# Altium project harmonicAnalyzerProject_r002.PrjPCB
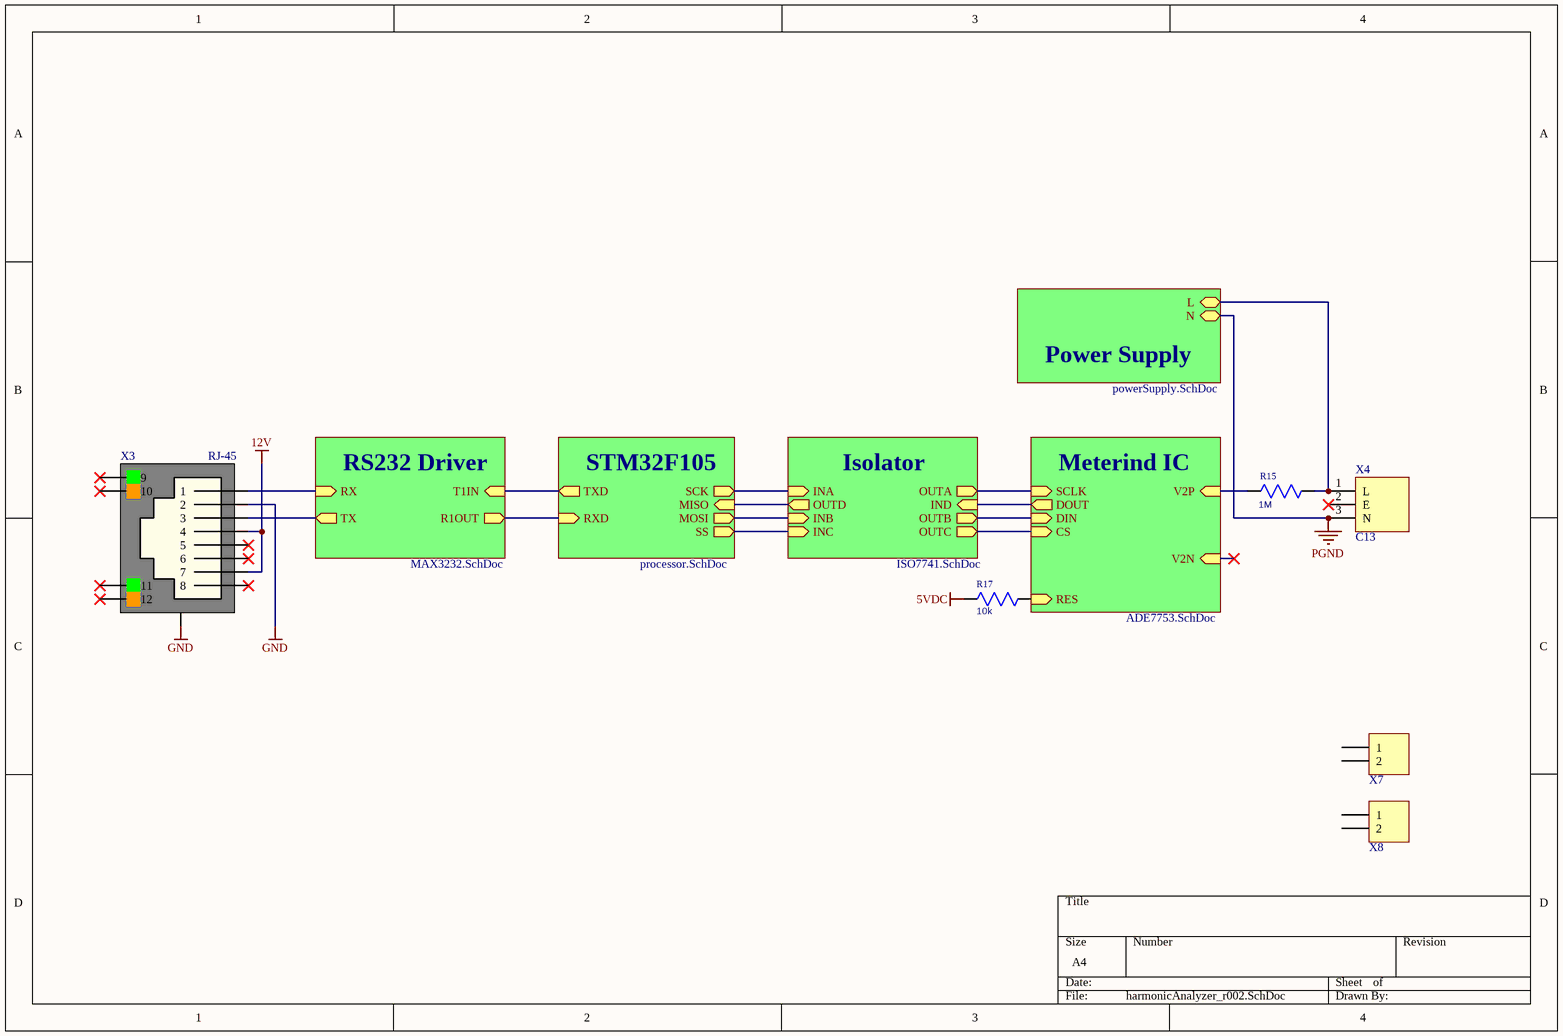
[diagram p0: harmonicAnalyzer_r002.SchDoc]
6 sheets, 90 parts. Net scope: hierarchical (ports join the sheet entries above them; power ports are global).
Board file: harmonicAnalyzerPcb_r002.PcbDoc
Sheets:
  harmonicAnalyzer_r002.SchDoc
    RS232 Driver = MAX3232.SchDoc
    STM32F105 = processor.SchDoc
    Power Supply = powerSupply.SchDoc
    Isolator = ISO7741.SchDoc
    Meterind IC = ADE7753.SchDoc

## Sheet harmonicAnalyzer_r002.SchDoc
size A4

### Parts
R15  1M  [R_0805]
R17  10k  [R_0603]
X3  RJ-45  [RJHSE-5E8X]
X4  C13  [C13_RA_TH]
X7  PBS-2  [PBS-2-3D]  (value not drawn)
X8  PBS-2  [PBS-2-3D]  (value not drawn)

### Sub-sheets
Isolator = ISO7741.SchDoc: OUTC (out), IND (in), INC (in), OUTD (out), INA (in), OUTB (out), OUTA (out), INB (in)
Meterind IC = ADE7753.SchDoc: DOUT (out), CS (in), V2N (in), V2P (in), DIN (in), RES (in), SCLK (in)
Power Supply = powerSupply.SchDoc: N (bidir), L (bidir)
RS232 Driver = MAX3232.SchDoc: T1IN (in), RX (in), TX (out), R1OUT (out)
STM32F105 = processor.SchDoc: MOSI (out), SS (out), MISO (in), RXD (in), SCK (out), TXD (out)

### Nets
5VDC: R17.1
12V: X3.4 X3.7
GND: X3.2 X3.13
PGND: X4.3(N) ; sheet Power Supply/N
CS: sheet Isolator/OUTC, sheet Meterind IC/CS
DIN: sheet Isolator/OUTB, sheet Meterind IC/DIN
DOUT: sheet Isolator/IND, sheet Meterind IC/DOUT
INA: sheet STM32F105/SCK, sheet Isolator/INA
INB: sheet STM32F105/MOSI, sheet Isolator/INB
INC: sheet STM32F105/SS, sheet Isolator/INC
OUTA: sheet Isolator/OUTA, sheet Meterind IC/SCLK
OUTD: sheet STM32F105/MISO, sheet Isolator/OUTD
R1OUT: sheet RS232 Driver/R1OUT, sheet STM32F105/RXD
RES: R17.2 ; sheet Meterind IC/RES
RX: X3.1 ; sheet RS232 Driver/RX
T1IN: sheet RS232 Driver/T1IN, sheet STM32F105/TXD
TX: X3.3 ; sheet RS232 Driver/TX
V2P: R15.1 ; sheet Meterind IC/V2P
NetFUSE1_1: R15.2 X4.1(L) ; sheet Power Supply/L

Not connected (* = marked no-connect by the designer): X3 5* 6* 8* 9* 10* 11* 12*; X4 2(E)*; X7 1 2; X8 1 2

### Library data of the parts
R15 = R0805: Resistor; Value: 1M
R17 = R0603: Resistor; Value: 10k
X3 = RJ-45: Jack Modular Connector
X7 X8 = PBS-2: Header, 2-Pin; LatestRevisionDate: 17-Jul-2002; LatestRevisionNote: Re-released for DXP Platform.; Publisher: Altium Limited

## Sheet MAX3232.SchDoc
size A4
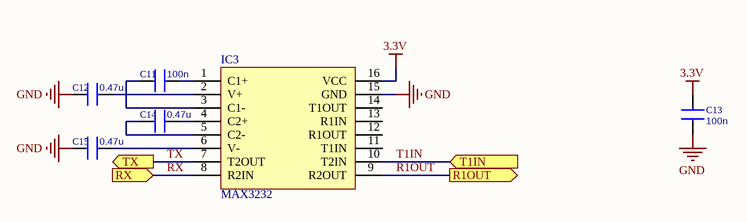
[diagram p1: MAX3232.SchDoc]

### Parts
C11  100n  [C_0805]
C12  0.47u  [C_0805]
C13  100n  [C_0805]
C14  0.47u  [C_0805]
C15  0.47u  [C_0805]
IC3  MAX3232  [SSOP-16]

### Ports
R1OUT (out), RX (in), T1IN (in), TX (out)

### Nets
3.3V: C13.2 IC3.16(VCC)
GND: C12.1 C13.1 C15.1 IC3.15(GND)
R1OUT: IC3.9(R2OUT) ; port R1OUT
RX: IC3.8(R2IN) ; port RX
T1IN: IC3.10(T2IN) ; port T1IN
TX: IC3.7(T2OUT) ; port TX
NetC11_1: C11.1 IC3.3(C1-)
NetC11_2: C11.2 IC3.1(C1+)
NetC12_2: C12.2 IC3.2(V+)
NetC14_1: C14.1 IC3.5(C2-)
NetC14_2: C14.2 IC3.4(C2+)
NetC15_2: C15.2 IC3.6(V-)

Not connected (* = marked no-connect by the designer): IC3 11(T1IN) 12(R1OUT) 13(R1IN) 14(T1OUT)

### Library data of the parts
C11-C15 = C0805: Capacitor
  C11 C13: Value: 100n
  C12 C14 C15: Value: 0.47u
IC3 = MAX3232: RS-232 Line Driver/Receiver With ±15-kV ESD Protection

## Sheet processor.SchDoc
size A4
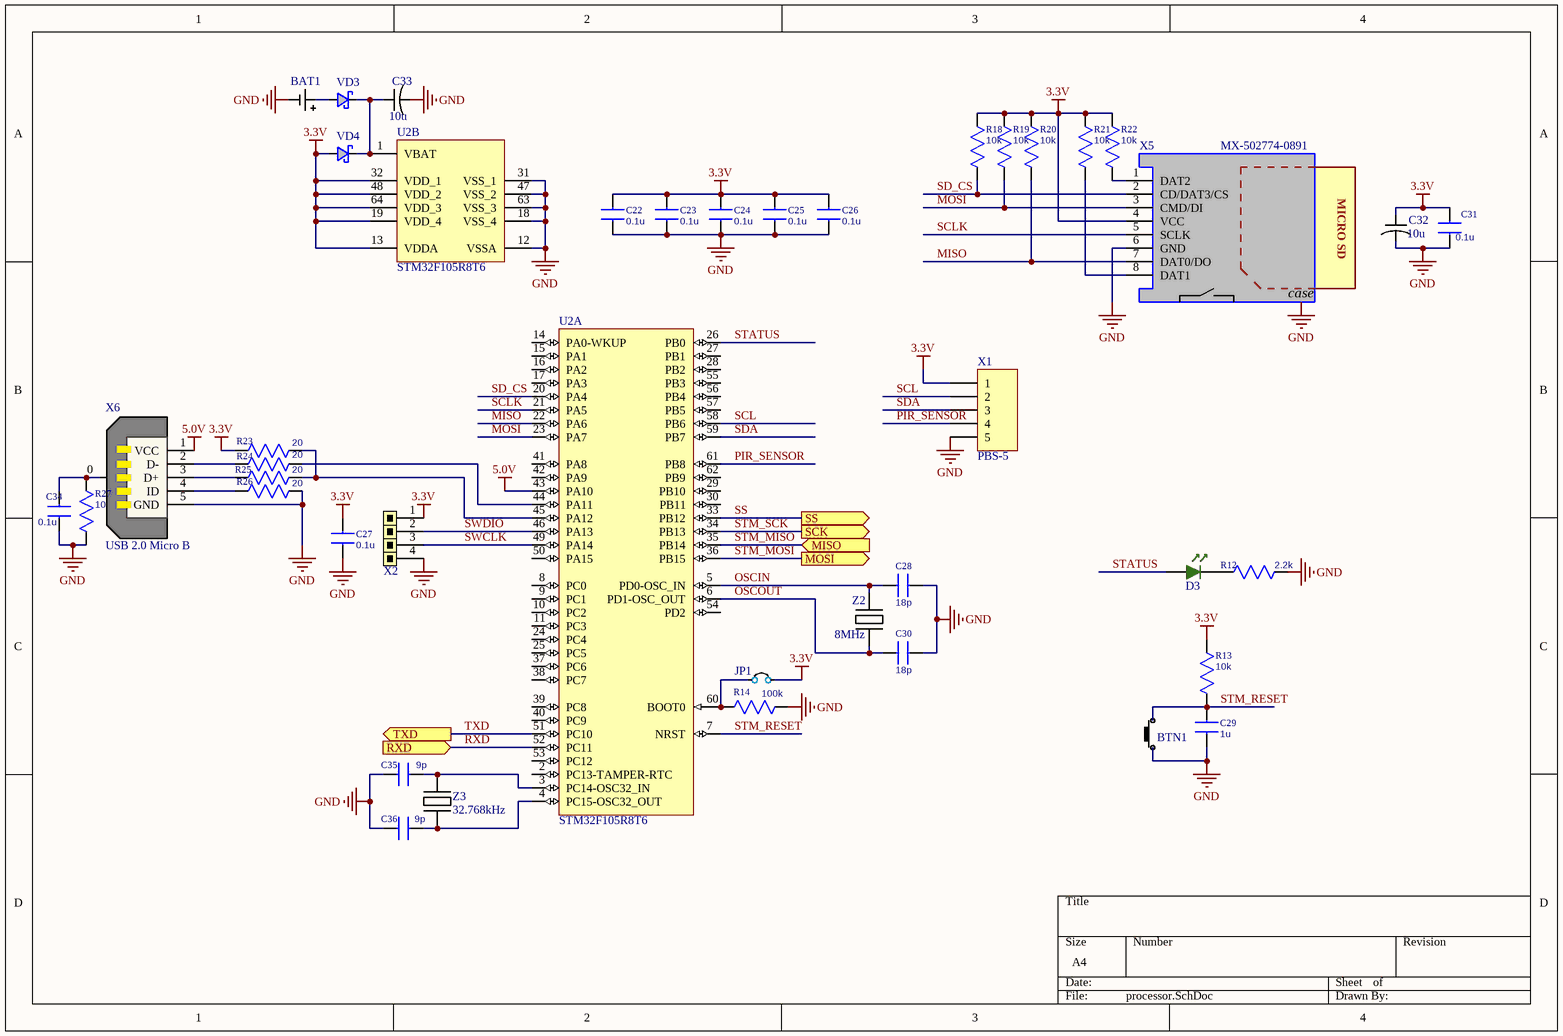
[diagram p2: processor.SchDoc]

### Parts
BAT1  Battery  [S8411-45R]  (value not drawn)
BTN1  Push Button  [PUSH BUTTON RIGHT ANGLE]  (value not drawn)
C22  0.1u  [C_0603]
C23  0.1u  [C_0603]
C24  0.1u  [C_0603]
C25  0.1u  [C_0603]
C26  0.1u  [C_0603]
C27  0.1u  [C_0603]
C28  18p  [C_0603]
C29  1u  [C_0603]
C30  18p  [C_0603]
C31  0.1u  [C_0603]
C32  10u  [TANTALUM_CAP_SIZE_A]
C33  10u  [TANTALUM_CAP_SIZE_A]
C34  0.1u  [C_0603]
C35  9p  [C_0603]
C36  9p  [C_0603]
D3  LED Green  [LED GREEN 3MM]  (value not drawn)
JP1  PLS-2  [PLS-2]  (value not drawn)
R12  2.2k  [R_0603]
R13  10k  [R_0603]
R14  100k  [R_0603]
R18  10k  [R_0603]
R19  10k  [R_0603]
R20  10k  [R_0603]
R21  10k  [R_0603]
R22  10k  [R_0603]
R23  20  [R_0603]
R24  20  [R_0603]
R25  20  [R_0603]
R26  20  [R_0603]
R27  10  [R_0603]
U2  STM32F105R8T6  [STM-LQFP64_N]  (parts A,B of 2)
VD3  Schottky Diode  [DO-214AA]  (value not drawn)
VD4  Schottky Diode  [DO-214AA]  (value not drawn)
X1  PBS-5  [PBS-5-3D]
X2  PLS-4  [PLS-4]  (value not drawn)
X5  MX-502774-0891  [MICRO SD SOCKET 2]
X6  USB 2.0 Micro B  [USB 2.0 MICRO B]
Z2  8MHz  [HC-49]
Z3  32.768kHz  [ST2012SB]

### Ports
MISO (in), MOSI (out), RXD (in), SCK (out), SS (out), TXD (out)

### Nets
3.3V: C22.1 C23.1 C24.1 C25.1 C26.1 C27.1 C31.1 C32.1 JP1.2 R13.1 R18.2 R19.2 R20.2 R21.2 R22.2 R23.1 U2.13(VDDA) U2.19(VDD_4) U2.32(VDD_1) U2.48(VDD_2) U2.64(VDD_3) VD4.A X1.1 X2.1 X5.4(VCC)
5.0V: U2.43(PA10) X6.1(VCC)
GND: BAT1.- BTN1.2 C22.2 C23.2 C24.2 C25.2 C26.2 C27.2 C28.1 C29.1 C30.1 C31.2 C32.2 C33.2 C34.2 C35.1 C36.1 R12.2 R14.1 R26.2 R27.2 U2.12(VSSA) U2.18(VSS_4) U2.31(VSS_1) U2.47(VSS_2) U2.63(VSS_3) X1.5 X2.4 X5.0(PCK) X5.6(GND) X6.5(GND)
MISO: R20.1 U2.22(PA6) X5.7(DAT0/DO)
MOSI: R19.1 U2.23(PA7) X5.3(CMD/DI)
OSCIN: C28.2 U2.5(PD0-OSC_IN) Z2.2
OSCOUT: C30.2 U2.6(PD1-OSC_OUT) Z2.1
PIR_SENSOR: U2.61(PB8) X1.4
RXD: U2.52(PC11) ; port RXD  [project net R1OUT]
SCL: U2.58(PB6) X1.2
SCLK: U2.21(PA5) X5.5(SCLK)
SD_CS: R18.1 U2.20(PA4) X5.2(CD/DAT3/CS)
SDA: U2.59(PB7) X1.3
SS: U2.33(PB12) ; port SS  [project net INC]
STATUS: D3.A U2.26(PB0)
STM_MISO: U2.35(PB14) ; port MISO  [project net OUTD]
STM_MOSI: U2.36(PB15) ; port MOSI  [project net INB]
STM_RESET: BTN1.1 C29.2 R13.2 U2.7(NRST)
STM_SCK: U2.34(PB13) ; port SCK  [project net INA]
SWCLK: U2.49(PA14) X2.3
SWDIO: U2.46(PA13) X2.2
TXD: U2.51(PC10) ; port TXD  [project net T1IN]
NetBAT1_+: BAT1.+ VD3.A
NetC33_1: C33.1 U2.1(VBAT) VD3.C VD4.C
NetC34_1: C34.1 R27.1 X6.0
NetC35_2: C35.2 U2.3(PC14-OSC32_IN) Z3.2
NetC36_2: C36.2 U2.4(PC15-OSC32_OUT) Z3.1
NetD3_C: D3.C R12.1
NetJP1_1: JP1.1 R14.2 U2.60(BOOT0)
NetR21_1: R21.1 X5.8(DAT1)
NetR22_1: R22.1 X5.1(DAT2)
NetR23_2: R23.2 R25.1 U2.45(PA12)
NetR24_1: R24.1 U2.44(PA11)
NetR24_2: R24.2 X6.2(D-)
NetR25_2: R25.2 X6.3(D+)
NetR26_1: R26.1 X6.4(ID)

Not connected (* = marked no-connect by the designer): U2 2(PC13-TAMPER-RTC) 8(PC0) 9(PC1) 10(PC2) 11(PC3) 14(PA0-WKUP) 15(PA1) 16(PA2) 17(PA3) 24(PC4) 25(PC5) 27(PB1) 28(PB2) 29(PB10) 30(PB11) 37(PC6) 38(PC7) 39(PC8) 40(PC9) 41(PA8) 42(PA9) 50(PA15) 53(PC12) 54(PD2) 55(PB3) 56(PB4) 57(PB5) 62(PB9); X5 9(SW1) 10(SW2)

### Notes on the sheet
- (in symbol Micro SD socket) MICRO SD; case

### Library data of the parts
C22-C31 C34-C36 = C0603: Capacitor
  C22-C27 C31 C34: Value: 0.1u
  C28 C30: Value: 18p
  C29: Value: 1u
  C35 C36: Value: 9p
C32 C33 = Tantalum Capacitor
JP1 = JP-2: Jumper Pins; Type: PLS-2
R12-R14 R18-R27 = R0603: Resistor
  R12: Value: 2.2k
  R13 R18-R22: Value: 10k
  R14: Value: 100k
  R23-R26: Value: 20
  R27: Value: 10
U2 = STM32F105R8T6: ARM Cortex-M3 32-bit MCU, 64 KB Flash, 64 KB Internal RAM, 51 I/Os, 64-pin LQFP, -40 to 85 degC, Tray; A/D Converter: 2x12-bit (16 Channel); D/A Converter: 2x12-bit (2 Channel); FLASH Size (Prog) (kB): 64; I/Os (High Current): 51; Operating Frequency(F) (Processor speed) (MHz): 72; Supply Voltage(Vcc) min (V): 2; DatasheetVersion: Rev. 6; PackageVersion: Rev. 4, 06/2013; PackageReference: LQFP64; PackageDescription: 64-Pin Low Profile Quad Flat Package, 10 x 10 mm Body, 0.5 mm Pitch; Supplier 1: Digi-Key; Supplier Part Number 1: 497-8922-ND; Supplier 2: Farnell; Supplier Part Number 2: 1737131; Supplier 3: Newark; Supplier Part Number 3: 52R2327; Supplier 4: Newark; Supplier Part Number 4: 25R9439; Supplier 5: Mouser; Supplier Part Number 5: 511-STM32F105R8T6; Core: ARM Cortex-M3; Internal RAM Size (kB): 64; Packing: Tray; Mounting Technology: Surface Mount; PartNumber: STM32F105R8T6; ComponentLink1Description: Manufacturer URL; ComponentLink1URL: http://www.st.com/web/en/home.html; ComponentLink2Description: Datasheet; ComponentLink2URL: http://www.st.com/st-web-ui/static/active/en/resource/technical/document/datasheet/CD00220364.pdf; ComponentLink3Description: Package Specification; ComponentLink3URL: http://www.st.com/st-web-ui/static/active/en/resource/technical/document/datasheet/DM00037051.pdf
VD3 VD4 = Schottky: SCHOTTKY BARRIER RECTIFIER
X1 = PBS-5: Header, 5-Pin; LatestRevisionDate: 17-Jul-2002; LatestRevisionNote: Re-released for DXP Platform.; Publisher: Altium Limited
X5 = Micro SD socket
Z2 Z3 = XTAL: Quartz resonator

## Sheet powerSupply.SchDoc
size A
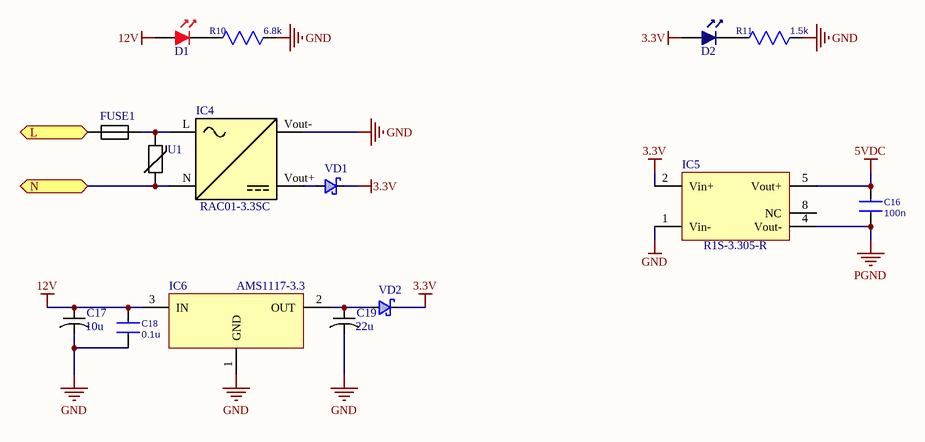
[diagram p3: powerSupply.SchDoc]

### Parts
C16  100n  [C_0603]
C17  10u  [TANTALUM_CAP_SIZE_A]
C18  0.1u  [C_0603]
C19  22u  [TANTALUM_CAP_SIZE_A]
D1  LED Red  [LED RED 3MM]  (value not drawn)
D2  LED Blue  [LED BLUE 3MM]  (value not drawn)
FUSE1  Fuse  [SF-2410FPXXXW]  (value not drawn)
IC4  RAC01-3.3SC  [RAC01-xxSGB]
IC5  R1S-3.305-R  [TES 1-0511]
IC6  AMS1117-3.3  [TO252AA]
R10  6.8k  [R_0603]
R11  1.5k  [R_0603]
U1  Varistor  [VARISTOR_45948]  (value not drawn)
VD1  Schottky Diode  [DO-214AA]  (value not drawn)
VD2  Schottky Diode  [DO-214AA]  (value not drawn)

### Ports
L (bidir), N (bidir)

### Nets
3.3V: D2.A IC5.2(Vin+) VD1.C VD2.C
5VDC: C16.2 IC5.5(Vout+)
12V: C17.1 C18.2 D1.A IC6.3(IN)
GND: C17.2 C18.1 C19.2 IC4.3(Vout-) IC5.1(Vin-) IC6.1(GND) R10.2 R11.2
PGND: C16.1 IC4.2(VAC(N)) IC5.4(Vout-) U1.2 ; port N
NetC19_1: C19.1 IC6.2(OUT) VD2.A
NetD1_C: D1.C R10.1
NetD2_C: D2.C R11.1
NetFUSE1_1: FUSE1.1 ; port L
NetFUSE1_2: FUSE1.2 IC4.1(VAC(L)) U1.1
NetIC4_4: IC4.4(Vout+) VD1.A

Not connected (* = marked no-connect by the designer): IC5 8(NC)

### Notes on the sheet
- (in symbol AC/DC) L; N

### Library data of the parts
C16 C18 = C0603: Capacitor
  C16: Value: 100n
  C18: Value: 0.1u
C17 C19 = Tantalum Capacitor
IC4 = AC/DC
IC5 = TES 1-0511: Isolated DC/DC Converter; Link: https://eu.mouser.com/ProductDetail/TRACO-Power/TES-1-0511?qs=sGAEpiMZZMsF1ODjcwEocH3QqeL6%2foLAEyBjyRDduFs%3d
IC6 = AMS1117-3.3: 1A LOW DROPOUT VOLTAGE REGULATOR
R10 R11 = R0603: Resistor
  R10: Value: 6.8k
  R11: Value: 1.5k
VD1 VD2 = Schottky: SCHOTTKY BARRIER RECTIFIER

## Sheet ISO7741.SchDoc
size A
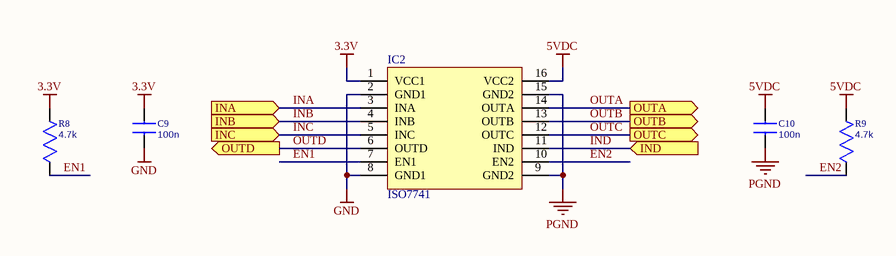
[diagram p4: ISO7741.SchDoc]

### Parts
C9  100n  [C_0603]
C10  100n  [C_0603]
IC2  ISO7741  [SOIC-16]
R8  4.7k  [R_0603]
R9  4.7k  [R_0603]

### Ports
INA (in), INB (in), INC (in), IND (in), OUTA (out), OUTB (out), OUTC (out), OUTD (out)

### Nets
3.3V: C9.2 IC2.1(VCC1) R8.2
5VDC: C10.2 IC2.16(VCC2) R9.2
GND: C9.1 IC2.2(GND1) IC2.8(GND1)
PGND: C10.1 IC2.9(GND2) IC2.15(GND2)
EN1: IC2.7(EN1) R8.1
EN2: IC2.10(EN2) R9.1
INA: IC2.3(INA) ; port INA
INB: IC2.4(INB) ; port INB
INC: IC2.5(INC) ; port INC
IND: IC2.11(IND) ; port IND  [project net DOUT]
OUTA: IC2.14(OUTA) ; port OUTA
OUTB: IC2.13(OUTB) ; port OUTB  [project net DIN]
OUTC: IC2.12(OUTC) ; port OUTC  [project net CS]
OUTD: IC2.6(OUTD) ; port OUTD

### Library data of the parts
C9 C10 = C0603: Capacitor; Value: 100n
IC2 = ISO7741: Quad-Channel Digital Isolators
R8 R9 = R0603: Resistor; Value: 4.7k

## Sheet ADE7753.SchDoc
size A
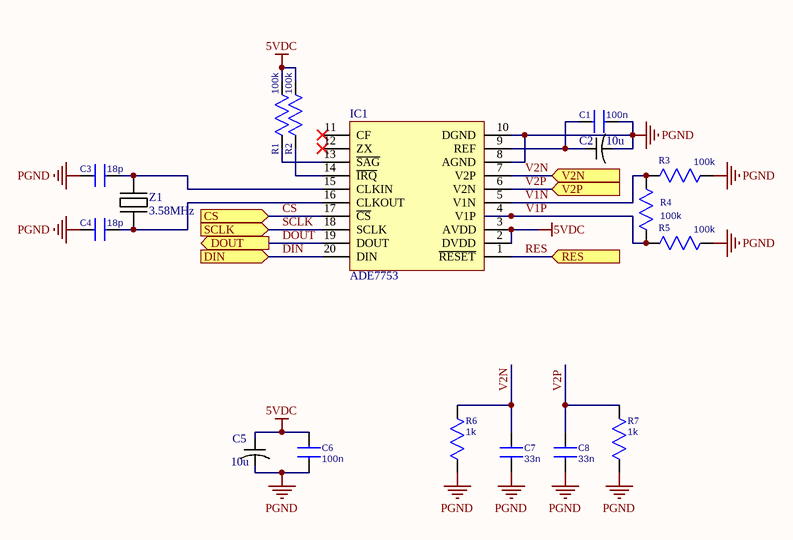
[diagram p5: ADE7753.SchDoc]

### Parts
C1  100n  [C_0603]
C2  10u  [TANTALUM_CAP_SIZE_A]
C3  18p  [C_0603]
C4  18p  [C_0603]
C5  10u  [TANTALUM_CAP_SIZE_A]
C6  100n  [C_0603]
C7  33n  [C_0603]
C8  33n  [C_0603]
IC1  ADE7753  [SOP-20]
R1  100k  [R_0603]
R2  100k  [R_0603]
R3  100k  [R_0603]
R4  100k  [R_0603]
R5  100k  [R_0603]
R6  1k  [R_0603]
R7  1k  [R_0805]
Z1  3.58MHz  [HC-49]

### Ports
CS (in), DIN (in), DOUT (out), RES (in), SCLK (in), V2N (in), V2P (in)

### Nets
5VDC: C5.1 C6.2 IC1.2(DVDD) IC1.3(AVDD) R1.2 R2.2
PGND: C1.2 C2.2 C3.1 C4.1 C5.2 C6.1 C7.1 C8.1 IC1.8(AGND) IC1.10(DGND) R3.1 R5.1 R6.2 R7.2
CS: IC1.17(~{CS}) ; port CS
DIN: IC1.20(DIN) ; port DIN
DOUT: IC1.19(DOUT) ; port DOUT
RES: IC1.1(~{RESET}) ; port RES
SCLK: IC1.18(SCLK) ; port SCLK  [project net OUTA]
V1N: IC1.5(V1N) R3.2 R4.2
V1P: IC1.4(V1P) R4.1 R5.2
V2N: C7.2 IC1.7(V2P) R6.1 ; port V2N
V2P: C8.2 IC1.6(V2N) R7.1 ; port V2P
NetC1_1: C1.1 C2.1 IC1.9(REF)
NetC3_2: C3.2 IC1.15(CLKIN) Z1.2
NetC4_2: C4.2 IC1.16(CLKOUT) Z1.1
NetIC1_13: IC1.13(~{SAG}) R1.1
NetIC1_14: IC1.14(~{IRQ}) R2.1

Not connected (* = marked no-connect by the designer): IC1 11(CF)* 12(ZX)*

### Library data of the parts
C1 C3 C4 C6-C8 = C0603: Capacitor
  C1 C6: Value: 100n
  C3 C4: Value: 18p
  C7 C8: Value: 33n
C2 C5 = Tantalum Capacitor
IC1 = ADE7753ARSZ: Data Acquisition ADC/DAC
R1-R6 = R0603: Resistor
  R1-R5: Value: 100k
  R6: Value: 1k
R7 = R0805: Resistor; Value: 1k
Z1 = XTAL: Quartz resonator

## Nets that join several sheets
3.3V: MAX3232 (C13.2 IC3.16), processor (25 pins), powerSupply (D2.A IC5.2 VD1.C VD2.C), ISO7741 (C9.2 IC2.1 R8.2)
5VDC: harmonicAnalyzer_r002 (R17.1), powerSupply (C16.2 IC5.5), ISO7741 (C10.2 IC2.16 R9.2), ADE7753 (6 pins)
12V: harmonicAnalyzer_r002 (X3.4 X3.7), powerSupply (C17.1 C18.2 D1.A IC6.3)
GND: harmonicAnalyzer_r002 (X3.2 X3.13), MAX3232 (C12.1 C13.1 C15.1 IC3.15), processor (31 pins), powerSupply (8 pins), ISO7741 (C9.1 IC2.2 IC2.8)
PGND: harmonicAnalyzer_r002 (X4.3), powerSupply (C16.1 IC4.2 IC5.4 U1.2), ISO7741 (C10.1 IC2.9 IC2.15), ADE7753 (14 pins)
CS: ISO7741 (IC2.12), ADE7753 (IC1.17)
DIN: ISO7741 (IC2.13), ADE7753 (IC1.20)
DOUT: ISO7741 (IC2.11), ADE7753 (IC1.19)
INA: processor (U2.34), ISO7741 (IC2.3)
INB: processor (U2.36), ISO7741 (IC2.4)
INC: processor (U2.33), ISO7741 (IC2.5)
NetFUSE1_1: harmonicAnalyzer_r002 (R15.2 X4.1), powerSupply (FUSE1.1)
OUTA: ISO7741 (IC2.14), ADE7753 (IC1.18)
OUTD: processor (U2.35), ISO7741 (IC2.6)
R1OUT: MAX3232 (IC3.9), processor (U2.52)
RES: harmonicAnalyzer_r002 (R17.2), ADE7753 (IC1.1)
RX: harmonicAnalyzer_r002 (X3.1), MAX3232 (IC3.8)
T1IN: MAX3232 (IC3.10), processor (U2.51)
TX: harmonicAnalyzer_r002 (X3.3), MAX3232 (IC3.7)
V2P: harmonicAnalyzer_r002 (R15.1), ADE7753 (C8.2 IC1.6 R7.1)